# EAGLE design EPC_FRONTAL (EAGLE 9.6.2)
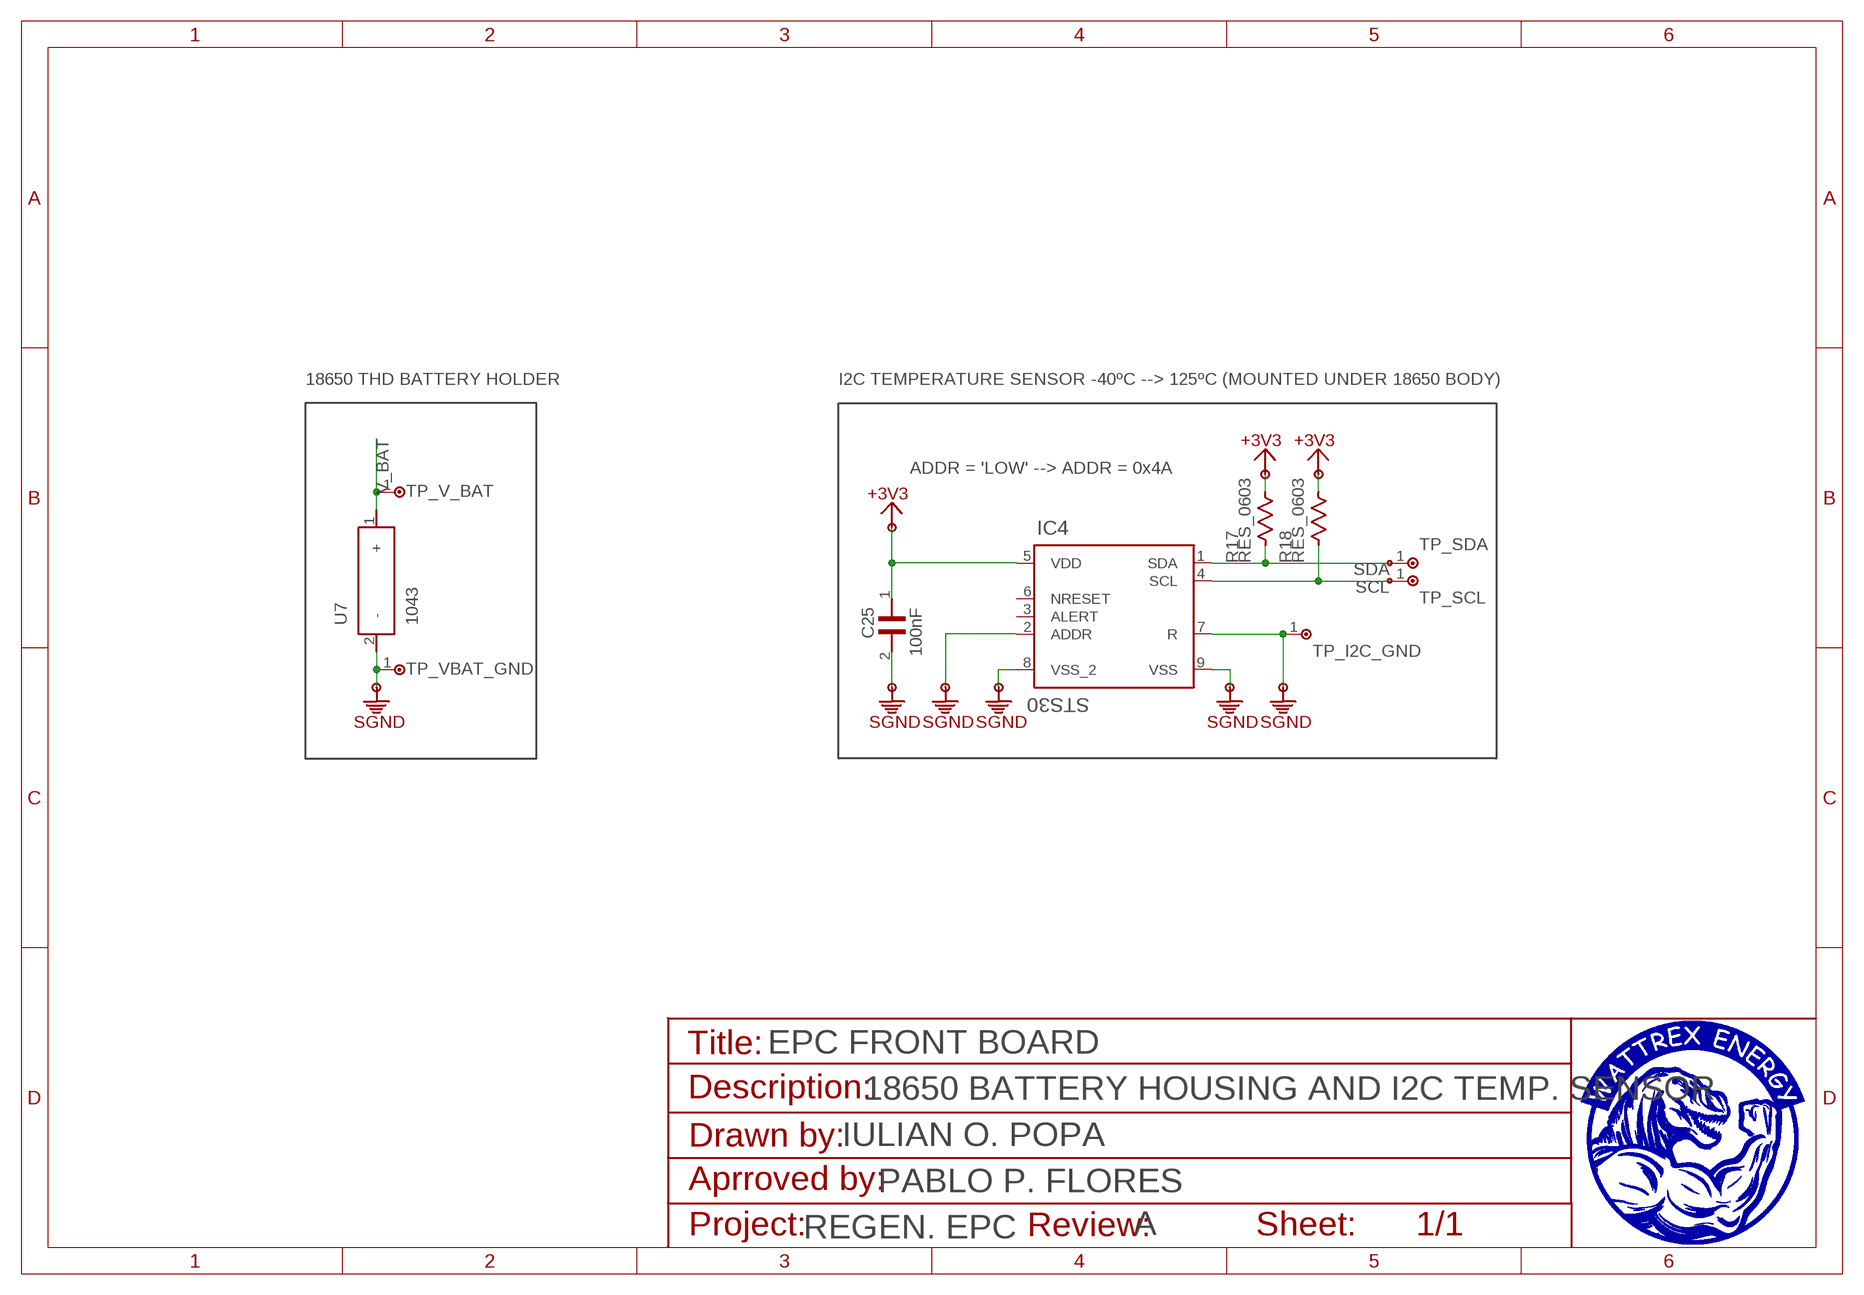
[diagram p0: schematic, sheet 1]

## Parts
C25  100nF  CAP_0603  [CAP_0603]
IC4  STS30  STS30-DISSTS3X-DIS_SEN-L  [DFN]
R17  RES_0603  [RES_0603]
R18  RES_0603  [RES_0603]
TP_I2C_GND  TP_S2751-46R  [TP_S2751-46R]
TP_SCL  TP_S2751-46R  [TP_S2751-46R]
TP_SDA  TP_S2751-46R  [TP_S2751-46R]
TP_V_BAT  TP_S2751-46R  [TP_S2751-46R]
TP_VBAT_GND  TP_S2751-46R  [TP_S2751-46R]
U7  1043  [1043]

## Nets
+3V3: C25.1 IC4.5(VDD) R17.2 R18.2
SCL: IC4.4(SCL) R18.1 TP_SCL.1(TP)
SDA: IC4.1(SDA) R17.1 TP_SDA.1(TP)
SGND: C25.2 IC4.2(ADDR) IC4.7(R) IC4.8(VSS_2) IC4.9(VSS) TP_I2C_GND.1(TP) TP_VBAT_GND.1(TP) U7.2(-) ; supply symbol labelled S_GND
V_BAT: TP_V_BAT.1(TP) U7.1(+)
Unconnected: IC4.3(ALERT) IC4.6(NRESET)

## Notes on the sheet
- 18650 THD BATTERY HOLDER | I2C TEMPERATURE SENSOR -40ºC --> 125ºC (MOUNTED UNDER 18650 BODY)
- ADDR = 'LOW' --> ADDR = 0x4A
- EPC FRONT BOARD
- 18650 BATTERY HOUSING AND I2C TEMP. SENSOR
- IULIAN O. POPA
- PABLO P. FLORES
- REGEN. EPC | A

## Library data of the parts
C25 = EPC_V2:CAP_0603
IC4 = EPC_V2:STS30-DIS; COPYRIGHT: Copyright (C) 2022 Ultra Librarian. All rights reserved.; MANUFACTURER_PART_NUMBER: STS30-DIS; MFR_NAME: Sensirion
R17 R18 = EPC_V2:RES_0603
TP_I2C_GND TP_SCL TP_SDA TP_V_BAT TP_VBAT_GND = VRFB_50kW:TP_S2751-46R: EZ-Test Point, SMT, tin, Tape and Reeled Check prices <https://pricing.snapeda.com/parts/S2751-46R/Harwin%20Inc./view-part?ref=eda>; AVAILABILITY: In Stock; DESCRIPTION: Natural PC Test Point Brass, Tin Plating Surface Mount Mounting Type; MF: Harwin Inc.; MP: S2751-46R; PACKAGE: None; PRICE: None; PURCHASE-URL: https://pricing.snapeda.com/search/part/S2751-46R/?ref=eda
U7 = EPC_V2:1043: KEYSTONE - 1043 - BATTERY HOLDER, 18650, TH Source: Datasheet <http://www.keyelco.com/product-pdf.cfm?p=919>; DESCRIPTION: KEYSTONE - 1043 - BATTERY HOLDER, 18650, TH; HEIGHT: 14.86mm; MANUFACTURER_NAME: Keystone Electronics; MANUFACTURER_PART_NUMBER: 1043; MOUSER_PART_NUMBER: 534-1043; MOUSER_PRICE-STOCK: https://www.mouser.co.uk/ProductDetail/Keystone-Electronics/1043?qs=%2F7TOpeL5Mz6j%2FnxeOA1rsg%3D%3D

## Board
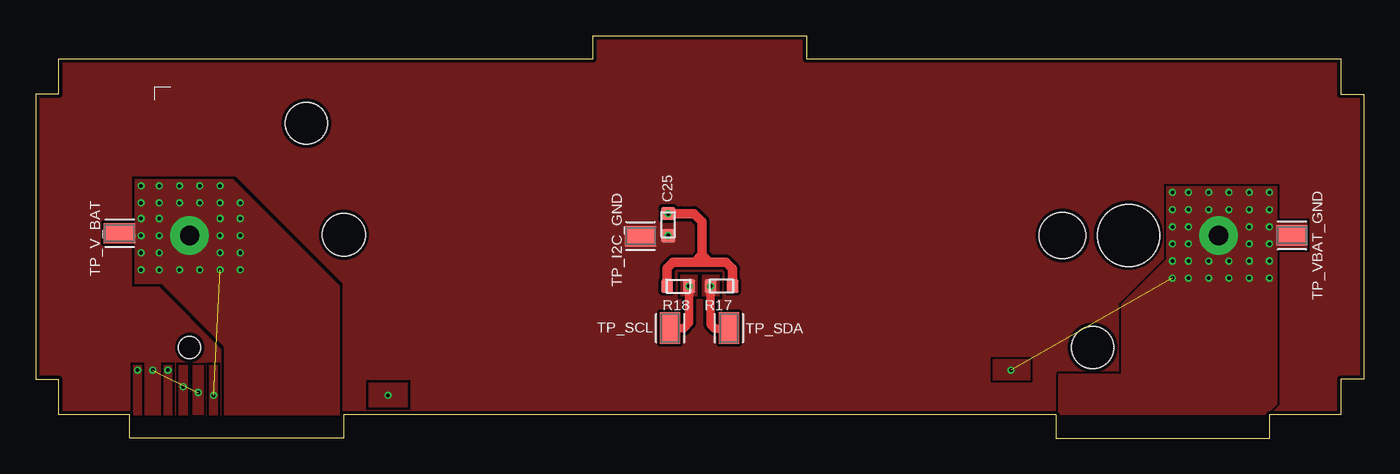
[diagram p1: board, top side]
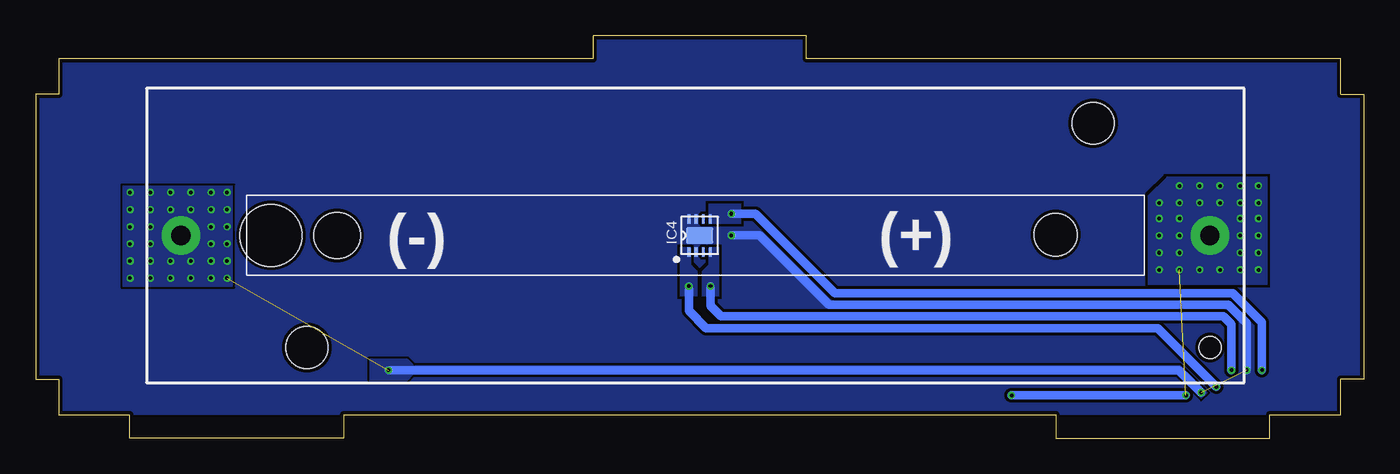
[diagram p2: board, bottom side, seen from below]

Size 93.24 x 28.24 mm. Coordinates in mm from the lower left corner, seen from the top.
Outline: 1.62,24.12 1.62,26.62 39.12,26.62 39.12,28.24 54.12,28.24 54.12,26.62 91.62,26.62 91.62,24.12 93.24,24.12 93.24,4.12 91.62,4.12 91.62,1.62 86.62,1.62 86.62,0 71.62,0 71.62,1.62 21.62,1.62 21.62,0 6.62,0 6.62,1.62 1.62,1.62 1.62,4.12 0,4.12 0,24.12 1.62,24.12
Copper layers (1+2*3+16): PWR 0.035mm / dielectric 0.36mm / PGND 0.07mm / dielectric 0.71mm / CGND 0.07mm / dielectric 0.36mm / SGND 0.035mm
Design rules "eC_4Layer_PClass4_BaseCopperO35-I70 *": minimum track width 0.2mm, minimum drill 0.25mm, track to track 0.2mm, track to pad 0.2mm, pad to pad 0.2mm, via to via 0.2mm, smd to smd 0mil, copper to edge 0.25mm, drill to drill 0.25mm, minimum pad ring 0.2mm, minimum via ring 0.125mm, stop-mask expansion 0mil, vias tented up to drill 0.45mm, thermal gap 0.2mm
Holes 3 mm at 21.64,14.27
Holes 3.25 mm at 72.08,14.22
tRestrict: 23 lines
bRestrict: 14 lines

### Footprints (pad centres in the part's own frame; a part is rotated, then mirrored left to right if it is on the bottom)
CAP_0603 = smd 0.92 x 0.97: 1 -0.775,0; 2 0.775,0
DFN = smd 0.657 x 0.255: 1 -1.167,0.75; 2 -1.167,0.25; 3 -1.167,-0.25; 4 -1.167,-0.75; 5 1.167,-0.75; 6 1.167,-0.25; 7 1.167,0.25; 8 1.167,0.75 | smd 1.194 x 1.905: 9 0,0
RES_0603 = smd 0.84 x 0.93: 1 -0.77,0; 2 0.77,0
TP_S2751-46R = smd 2.2 x 1.4: 1 0,0
1043 = drill 1.35 pad 2.7: 1 0,0; 2 -72.22,0 | hole 1.55: 0,-7.87 | hole 2.95: -63.39,-7.87; -8.2,7.87 | hole 4.35: -65.9,0

### Placement (x,y rotation side)
C25  44.4,14.98 270 top
IC4  46.63,14.22 90 bottom
R17  48.16,10.66 0 top
R18  45.11,10.66 180 top
TP_I2C_GND  42.46,14.17 180 top
TP_SCL  44.55,7.72 90 top
TP_SDA  48.66,7.72 90 top
TP_V_BAT  5.89,14.37 180 top
TP_VBAT_GND  88.18,14.22 0 top
U7  10.81,14.22 0 bottom

### Tracks (layer width: path | path; a pad name or v marks a point on that pad's centre or on a via)
+3V3  (via drill 0.25 pad 0.5)
  PWR 0.5: 45.26,15.76 45.24,15.74 v44.4,15.74
  PWR 0.65: R17.2 48.93,11.87 48.46,12.34 47.29,12.34 | 47.29,12.34 46.78,12.34 | 46.78,12.34 46.28,12.34 | 46.28,12.34 44.75,12.34 44.34,11.92 R18.2 | C25.1 45.26,15.76 46.21,15.76 46.78,15.18 46.78,12.85 | 46.78,12.85 46.78,12.34 | 46.78,12.85 47.29,12.34 | 46.78,12.85 46.28,12.34
  SGND 0.6: v7.16,4.77 7.16,8.12 9.19,10.16 37.13,10.16 42.72,15.74 v44.4,15.74
  pour SGND (no thermals): 46.02,15.08 43.74,15.08 43.74,16.4 46.02,16.4
  pour PWR (no thermals): 7.46,5.08 6.85,5.08 6.85,1.62 7.46,1.62
SCL  (via drill 0.25 pad 0.5)
  PWR 0.6: R18.1 45.88,8.08 45.51,7.72 TP_SCL.1
  SGND 0.6: v45.87,10.66 45.87,9.29 45.13,8.56 9.88,8.56 9.29,7.97 v9.29,4.77
  pour SGND (no thermals): 46.02,13.35 46.02,12.14 46.48,11.68 46.48,10 45.26,10 45.26,13.35
  pour PWR (no thermals): 9.6,5.08 8.99,5.08 8.99,1.62 9.6,1.62
  pour PWR (no thermals): 46.48,11.43 45.26,11.43 45.26,10 46.48,10
SDA  (via drill 0.25 pad 0.5)
  PWR 0.3: R17.1 v47.39,10.66
  PWR 0.6: R17.1 47.39,7.98 47.7,7.67 48.61,7.67 TP_SDA.1
  SGND 0.6: v10.36,3.6 14.47,7.72 46.17,7.72 47.39,8.94 v47.39,10.66
  pour SGND (no thermals): 46.78,10 46.78,11.68 47.24,12.14 47.24,13.35 48,13.35 48,10
  pour PWR (no thermals): 10.66,5.08 10.05,5.08 10.05,1.62 10.66,1.62
  pour PWR (no thermals): 48,11.43 46.78,11.43 46.78,10 48,10
SGND  (via drill 0.25 pad 0.5)  (2 unrouted)
  PWR 0.3: C25.2 v44.4,14.22
  SGND 0.6: v8.22,4.77 8.21,4.78 8.21,8.05 9.52,9.36 37.55,9.36 42.42,14.22 v44.4,14.22 | v68.47,4.77 13,4.77 v11.42,3.2
  other vias: 86.61,16.02 86.61,14.82 86.61,11.22 86.61,13.62 86.61,12.42 85.19,16.02 85.19,14.82 85.19,11.22 85.19,13.62 85.19,12.42 83.77,16.02 83.77,11.22 82.34,16.02 80.92,16.02 80.92,14.82 80.92,11.22 80.92,13.62 80.92,12.42 79.8,16.02 79.8,14.82 79.8,11.22 79.8,13.62 79.8,12.42 82.34,11.22 86.61,17.24 85.19,17.24 83.77,17.24 82.34,17.24 80.92,17.24 79.8,17.24 83.77,12.42 82.34,12.42
  pour SGND (no thermals): 43.74,13.61 46.78,13.61 46.78,12.75 46.99,12.75 46.99,13.61 48,13.61 48,15.74 46.73,15.74 46.73,14.83 43.74,14.83
  pour PWR (no thermals): 67.15,3.96 69.89,3.96 69.89,5.64 67.15,5.64
  pour PWR (no thermals): 76.19,1.62 76.19,9.34 79.4,12.54 79.4,17.67 87.12,17.67 87.12,2.54 86.35,1.82 86.35,1.62
  pour PWR (no thermals): 8.53,5.08 7.92,5.08 7.92,1.62 8.53,1.62
  pour PWR (no thermals): 11.73,5.08 11.12,5.08 11.12,1.62 11.73,1.62
  pour PWR (no thermals): 41.4,14.88 45.21,14.88 45.21,13.46 41.4,13.46
  pour PWR (rank 2, no thermals): 91.64,1.62 91.64,4.11 93.26,4.11 93.26,24.13 91.64,24.13 91.64,26.62 54.15,26.62 54.15,28.24 39.11,28.24 39.11,26.62 1.62,26.62 1.62,24.13 -0.01,24.13 -0.01,4.11 1.62,4.11 1.62,1.62
  pour SGND (no thermals): 79.29,17.78 87.22,17.78 87.22,10.56 79.29,10.56
  pour SGND (rank 2, no thermals): 91.64,1.62 91.64,4.11 93.26,4.11 93.26,24.13 91.64,24.13 91.64,26.62 54.15,26.62 54.15,28.24 39.11,28.24 39.11,26.62 1.62,26.62 1.62,24.13 -0.01,24.13 -0.01,4.11 1.62,4.11 1.62,1.62
V_BAT  (via drill 0.25 pad 0.5)  (1 unrouted)
  SGND 0.6: v24.73,2.99 v12.49,2.99
  other vias: 8.68,11.81 8.68,13.01 8.68,16.5 8.68,14.21 8.68,15.41 10.1,11.81 10.1,16.5 11.52,11.81 12.95,11.81 12.95,13.01 12.95,16.5 12.95,14.21 12.95,15.41 14.37,11.81 14.37,13.01 14.37,16.5 14.37,14.21 14.37,15.41 11.52,16.5 7.41,11.81 7.41,13.01 7.41,16.5 7.41,14.21 7.41,15.41 8.68,17.7 10.1,17.7 11.52,17.7 12.95,17.7 7.41,17.7
  pour PWR (no thermals): 26.1,2.18 26.1,3.86 23.36,3.86 23.36,2.18
  pour PWR (no thermals): 13.25,1.62 21.33,1.62 21.33,10.66 13.86,18.13 6.95,18.13 6.95,10.87 8.83,10.87 13.25,6.45
  pour PWR (no thermals): 12.8,5.08 12.19,5.08 12.19,1.62 12.8,1.62
  pour SGND (no thermals): 6.8,18.28 13.81,18.28 15.13,16.96 15.13,10.82 6.8,10.82